# Altium project remote.PrjPcb
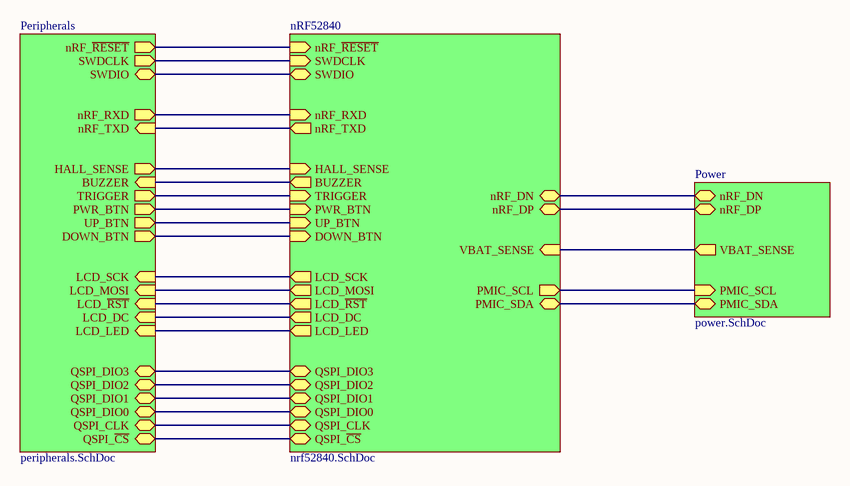
[diagram p0: remote.SchDoc]
4 sheets, 103 parts. Net scope: hierarchical (ports join the sheet entries above them; power ports are global).
Board files: remote.PcbDoc, buttons.PcbDoc
Sheets:
  remote.SchDoc
    nRF52840 = nrf52840.SchDoc
    Power = power.SchDoc
    Peripherals = peripherals.SchDoc

## Sheet remote.SchDoc: Electric Skateboard Remote
size A; Revision: 0.0.1; SheetNumber: 1

### Sub-sheets
nRF52840 = nrf52840.SchDoc: nRF_RXD (in), UP_BTN (in), QSPI_DIO1 (bidir), QSPI_~{CS} (bidir), DOWN_BTN (in), BUZZER (out), nRF_~{RESET} (in), SWDIO (bidir), LCD_DC (out), nRF_DN (bidir), QSPI_DIO0 (bidir), LCD_SCK (out), nRF_DP (bidir), QSPI_DIO2 (bidir), QSPI_CLK (bidir), SWDCLK (in), HALL_SENSE (in), LCD_MOSI (out), PWR_BTN (in), TRIGGER (in), LCD_~{RST} (out), QSPI_DIO3 (bidir), nRF_TXD (out), VBAT_SENSE (in), PMIC_SCL (out), PMIC_SDA (bidir), LCD_LED (out)
Peripherals = peripherals.SchDoc: LCD_SCK (in), LCD_MOSI (in), LCD_~{RST} (in), LCD_DC (in), SWDCLK (out), nRF_~{RESET} (out), SWDIO (bidir), nRF_TXD (in), nRF_RXD (out), QSPI_~{CS} (bidir), QSPI_CLK (bidir), QSPI_DIO0 (bidir), QSPI_DIO1 (bidir), QSPI_DIO2 (bidir), QSPI_DIO3 (bidir), LCD_LED (in), BUZZER (in), DOWN_BTN (out), TRIGGER (out), HALL_SENSE (out), PWR_BTN (out), UP_BTN (out)
Power = power.SchDoc: nRF_DP (bidir), nRF_DN (bidir), VBAT_SENSE (out), PMIC_SDA (bidir), PMIC_SCL (in)

### Nets
A8: sheet nRF52840/VBAT_SENSE, sheet Power/VBAT_SENSE
A10: sheet nRF52840/BUZZER, sheet Peripherals/BUZZER
A12: sheet nRF52840/PWR_BTN, sheet Peripherals/PWR_BTN
A14: sheet nRF52840/UP_BTN, sheet Peripherals/UP_BTN
A16: sheet nRF52840/DOWN_BTN, sheet Peripherals/DOWN_BTN
A20: sheet nRF52840/TRIGGER, sheet Peripherals/TRIGGER
AC13: sheet nRF52840/nRF_~{RESET}, sheet Peripherals/nRF_~{RESET}
AC15: sheet nRF52840/QSPI_CLK, sheet Peripherals/QSPI_CLK
AC17: sheet nRF52840/QSPI_DIO1, sheet Peripherals/QSPI_DIO1
AC19: sheet nRF52840/QSPI_DIO3, sheet Peripherals/QSPI_DIO3
AD12: sheet nRF52840/QSPI_~{CS}, sheet Peripherals/QSPI_~{CS}
AD16: sheet nRF52840/QSPI_DIO0, sheet Peripherals/QSPI_DIO0
AD18: sheet nRF52840/QSPI_DIO2, sheet Peripherals/QSPI_DIO2
J1: sheet nRF52840/LCD_LED, sheet Peripherals/LCD_LED
K2: sheet nRF52840/HALL_SENSE, sheet Peripherals/HALL_SENSE
L1: sheet nRF52840/LCD_~{RST}, sheet Peripherals/LCD_~{RST}
M2: sheet nRF52840/PMIC_SCL, sheet Power/PMIC_SCL
N1: sheet nRF52840/LCD_MOSI, sheet Peripherals/LCD_MOSI
P2: sheet nRF52840/PMIC_SDA, sheet Power/PMIC_SDA
P23: sheet nRF52840/nRF_TXD, sheet Peripherals/nRF_TXD
R1: sheet nRF52840/LCD_SCK, sheet Peripherals/LCD_SCK
R24: sheet nRF52840/nRF_RXD, sheet Peripherals/nRF_RXD
U1: sheet nRF52840/LCD_DC, sheet Peripherals/LCD_DC
USB_N: sheet nRF52840/nRF_DN, sheet Power/nRF_DN
USB_P: sheet nRF52840/nRF_DP, sheet Power/nRF_DP
NetJ1_2: sheet nRF52840/SWDCLK, sheet Peripherals/SWDCLK
NetJ1_3: sheet nRF52840/SWDIO, sheet Peripherals/SWDIO

## Sheet nrf52840.SchDoc: nRF52840
size A; DocumentNumber: 1; Revision: 0.0.1; SheetNumber: 2; SheetTotal: 4
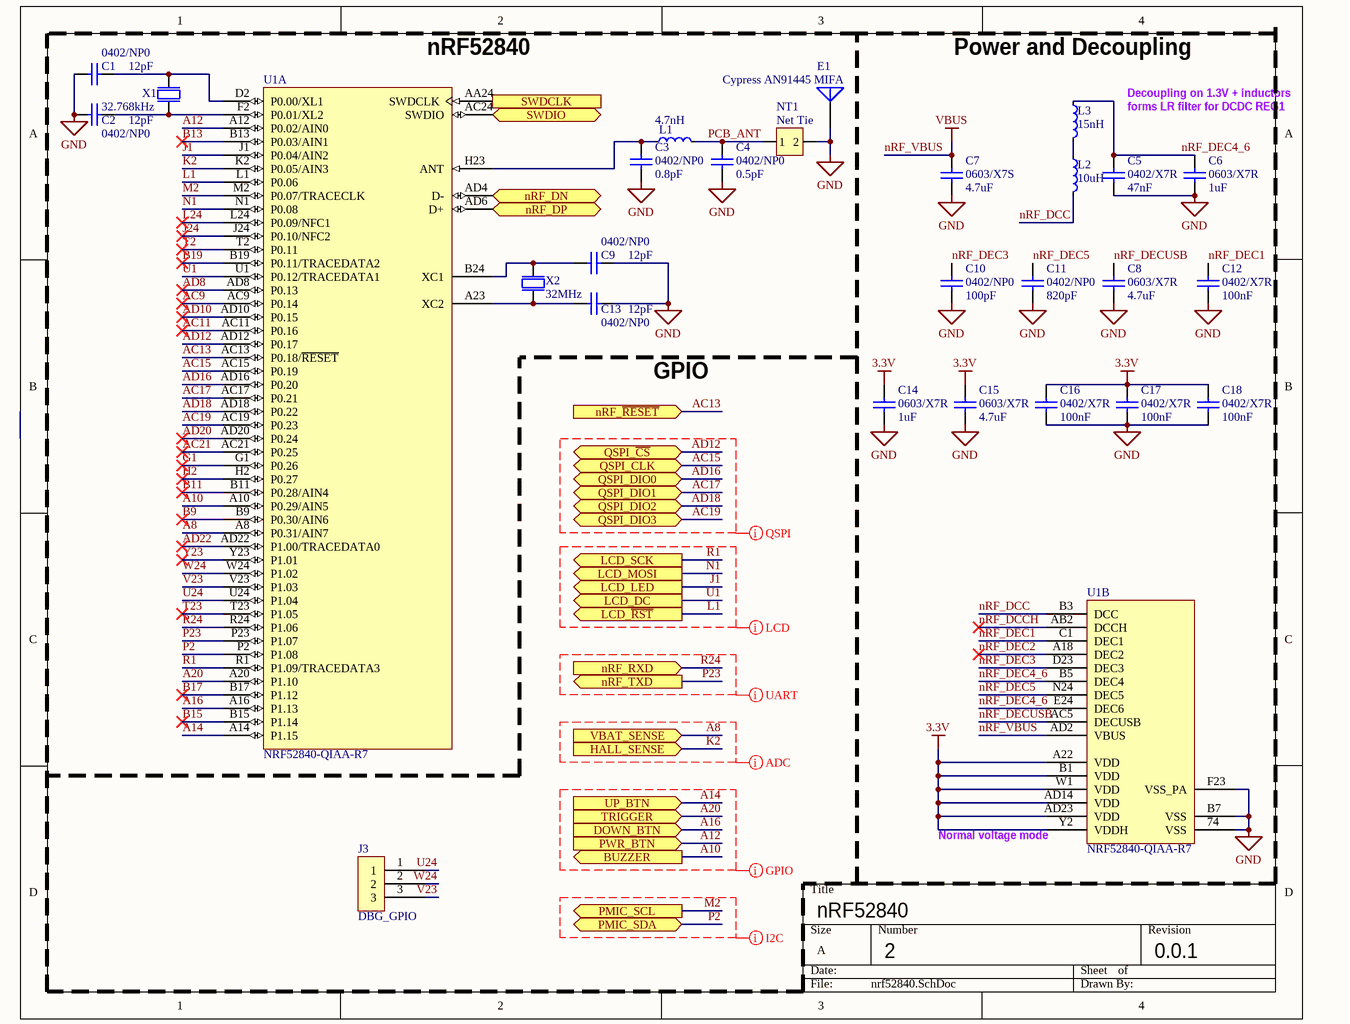
[diagram p1: nrf52840.SchDoc]

### Parts
C1  0402/NP0  value 12pF  [CAPC1005X04L]
C2  0402/NP0  value 12pF  [CAPC1005X04L]
C3  0402/NP0  value 0.8pF  [CAPC1005X04L]
C4  0402/NP0  value 0.5pF  [CAPC1005X04L]
C5  0402/X7R  value 47nF  [CAPC1005X04L]
C6  0603/X7R  value 1uF  [CAPC1608X06L]
C7  0603/X7S  value 4.7uF  [CAPC1608X06L]
C8  0603/X7R  value 4.7uF  [CAPC1608X06L]
C9  0402/NP0  value 12pF  [CAPC1005X04L]
C10  0402/NP0  value 100pF  [CAPC1005X04L]
C11  0402/NP0  value 820pF  [CAPC1005X04L]
C12  0402/X7R  value 100nF  [CAPC1005X04L]
C13  0402/NP0  value 12pF  [CAPC1005X04L]
C14  0603/X7R  value 1uF  [CAPC1608X06L]
C15  0603/X7R  value 4.7uF  [CAPC1608X06L]
C16  0402/X7R  value 100nF  [CAPC1005X04L]
C17  0402/X7R  value 100nF  [CAPC1005X04L]
C18  0402/X7R  value 100nF  [CAPC1005X04L]
E1  Cypress AN91445 MIFA  [Cypress_AN91445_MIFA]
J3  DBG_GPIO  [DBG_Header]
L1  4.7nH  [INDC1005X04L]
L2  10uH  [INDC1608X06L]
L3  15nH  [INDC1005X04L]
NT1  Net Tie  [MIFA_NET_TIE]  (net tie, no BOM)
U1  NRF52840-QIAA-R7  [AQFN50P700X700X85_HS-74N]  (parts A,B of 2)
X1  32.768kHz  [XTAL_3215]
X2  32MHz  [BT-XTAL_2016]

### Ports
BUZZER (out), DOWN_BTN (in), HALL_SENSE (in), LCD_DC (out), LCD_LED (out), LCD_MOSI (out), LCD_SCK (out), LCD_~{RST} (out), nRF_DN (bidir), nRF_DP (bidir), nRF_RXD (in), nRF_TXD (out), nRF_~{RESET} (in), PMIC_SCL (out), PMIC_SDA (bidir), PWR_BTN (in), QSPI_CLK (bidir), QSPI_DIO0 (bidir), QSPI_DIO1 (bidir), QSPI_DIO2 (bidir), QSPI_DIO3 (bidir), QSPI_~{CS} (bidir), SWDCLK (in), SWDIO (bidir), TRIGGER (in), UP_BTN (in), VBAT_SENSE (in)

### Nets
3.3V: C14.1 C15.1 C16.1 C17.1 C18.2 U1.A22(VDD) U1.AD14(VDD) U1.AD23(VDD) U1.B1(VDD) U1.W1(VDD) U1.Y2(VDDH)
GND: C1.2 C2.2 C3.2 C4.2 C5.2 C6.2 C7.2 C8.2 C9.1 C10.2 C11.2 C12.2 C13.1 C14.2 C15.2 C16.2 C17.2 C18.1 E1.1 NT1.2 U1.74(VSS) U1.B7(VSS) U1.F23(VSS_PA) X2.2(GND) X2.4(GND)
nRF_VBUS: C7.1 U1.AD2(VBUS)  [also labelled VBUS]
A8: U1.A8(P0.31/AIN7) ; port VBAT_SENSE
A10: U1.A10(P0.29/AIN5) ; port BUZZER
A12: U1.A12(P0.02/AIN0) ; port PWR_BTN
A14: U1.A14(P1.15) ; port UP_BTN
A16: U1.A16(P1.13) ; port DOWN_BTN
A20: U1.A20(P1.10) ; port TRIGGER
AC9: U1.AC9(P0.14)
AC11: U1.AC11(P0.16)
AC13: U1.AC13(P0.18/~{RESET}) ; port nRF_~{RESET}
AC15: U1.AC15(P0.19) ; port QSPI_CLK
AC17: U1.AC17(P0.21) ; port QSPI_DIO1
AC19: U1.AC19(P0.23) ; port QSPI_DIO3
AC21: U1.AC21(P0.25)
AD8: U1.AD8(P0.13)
AD10: U1.AD10(P0.15)
AD12: U1.AD12(P0.17) ; port QSPI_~{CS}
AD16: U1.AD16(P0.20) ; port QSPI_DIO0
AD18: U1.AD18(P0.22) ; port QSPI_DIO2
AD20: U1.AD20(P0.24)
AD22: U1.AD22(P1.00/TRACEDATA0)
B9: U1.B9(P0.30/AIN6)
B11: U1.B11(P0.28/AIN4)
B13: U1.B13(P0.03/AIN1)
B15: U1.B15(P1.14)
B17: U1.B17(P1.12)
B19: U1.B19(P0.11/TRACEDATA2)
G1: U1.G1(P0.26)
H2: U1.H2(P0.27)
J1: U1.J1(P0.04/AIN2) ; port LCD_LED
J24: U1.J24(P0.10/NFC2)
K2: U1.K2(P0.05/AIN3) ; port HALL_SENSE
L1: U1.L1(P0.06) ; port LCD_~{RST}
L24: U1.L24(P0.09/NFC1)
M2: U1.M2(P0.07/TRACECLK) ; port PMIC_SCL
N1: U1.N1(P0.08) ; port LCD_MOSI
nRF_DCC: L2.2 U1.B3(DCC)
nRF_DCCH: U1.AB2(DCCH)
nRF_DEC1: C12.1 U1.C1(DEC1)
nRF_DEC2: U1.A18(DEC2)
nRF_DEC3: C10.1 U1.D23(DEC3)
nRF_DEC4_6: C5.1 C6.1 L3.1 U1.B5(DEC4) U1.E24(DEC6)
nRF_DEC5: C11.1 U1.N24(DEC5)
nRF_DECUSB: C8.1 U1.AC5(DECUSB)
P2: U1.P2(P1.08) ; port PMIC_SDA
P23: U1.P23(P1.07) ; port nRF_TXD
PCB_ANT: C4.1 L1.2 NT1.1
R1: U1.R1(P1.09/TRACEDATA3) ; port LCD_SCK
R24: U1.R24(P1.06) ; port nRF_RXD
T2: U1.T2(P0.11)
T23: U1.T23(P1.05)
U1: U1.U1(P0.12/TRACEDATA1) ; port LCD_DC
U24: J3.1 U1.U24(P1.04)
USB_N: U1.AD4(D-) ; port nRF_DN
USB_P: U1.AD6(D+) ; port nRF_DP
V23: J3.3 U1.V23(P1.03)
W24: J3.2 U1.W24(P1.02)
Y23: U1.Y23(P1.01)
NetC1_1: C1.1 U1.D2(P0.00/XL1) X1.2(out)
NetC2_1: C2.1 U1.F2(P0.01/XL2) X1.1(inp)
NetC3_1: C3.1 L1.1 U1.H23(ANT)
NetC9_2: C9.2 U1.B24(XC1) X2.1(inp)
NetC13_2: C13.2 U1.A23(XC2) X2.3(out)
NetJ1_2: U1.AA24(SWDCLK) ; port SWDCLK
NetJ1_3: U1.AC24(SWDIO) ; port SWDIO
NetL2_1: L2.1 L3.2

### Layout directives
net class QSPI: AC15, AC17, AC19, AD12, AD16, AD18
net class LCD: J1, L1, N1, R1, U1
net class UART: A8, A10, A12, A14, A16, A20, K2, M2, P2, P23, R24

### Notes on the sheet
- (near U1) nRF52840
- (near L3) Power and Decoupling
- Decoupling on 1.3V + inductors
- forms LR filter for DCDC REG1
- GPIO
- (near U1) Normal voltage mode

### Library data of the parts
C1-C18 = Cap: Capacitor; Published: 8-Jun-2000; LatestRevisionDate: 17-Jul-2002; LatestRevisionNote: Re-released for DXP Platform.; PackageReference: RAD-0.3; Publisher: Altium Limited; PackageDescription: Radial Cap, Thru-Hole; 2 Leads; 0.3 in Pin Spacing; ComponentLink1Description: Digikey
  C1 C2 C9 C13: ComponentLink1URL: https://www.digikey.com/product-detail/en/walsin-technology-corporation/0402N120G500CT/1292-1250-1-ND/9355254
  C3: ComponentLink1URL: https://www.digikey.com/product-detail/en/johanson-technology-inc/500R07S0R8AV4T/712-1604-1-ND/6612940
  C4: ComponentLink1URL: https://www.digikey.com/product-detail/en/johanson-technology-inc/500R07S0R5AV4T/712-1247-1-ND/1786709
  C5: ComponentLink1URL: https://www.digikey.com/product-detail/en/w-rth-elektronik/885012205035/732-7530-1-ND/5454157
  C6 C14: ComponentLink1URL: https://www.digikey.com/product-detail/en/avx-corporation/0603YC105JAT2A/478-10814-1-ND/7536449
  C7: ComponentLink1URL: https://www.digikey.com/product-detail/en/tdk-corporation/C1608X7S1A475K080AC/445-14258-1-ND/3955924
  C8 C15: ComponentLink1URL: https://www.digikey.com/product-detail/en/samsung-electro-mechanics/CL10B475KQ8NQNC/1276-2087-1-ND/3890173
  C10: ComponentLink1URL: https://www.digikey.com/product-detail/en/samsung-electro-mechanics/CL05C101JB5NNNC/1276-1025-1-ND/3889111
  C11: ComponentLink1URL: https://www.digikey.com/product-detail/en/samsung-electro-mechanics/CL05C821JB5NNNC/1276-1727-1-ND/3889813
  C12 C16-C18: ComponentLink1URL: https://www.digikey.com/product-detail/en/w-rth-elektronik/885012205037/732-7532-1-ND/5454159
E1 = MIFA
J3 = Debug_Header
L1-L3 = IND_0402: High frequency chip inductor ±5%; Part Number: L0402-3n9; LatestRevisionDate: 2012-09-19; Pin Count: 2; Publisher: Nordic Semiconductor; Published: 2009-05-08; Note: High frequency chip inductor ±5%; Footprint Doc: 0402; ComponentLink1Description: Digikey
  L1: Value: 4.7nH; ComponentLink1URL: https://www.digikey.com/product-detail/en/delta-electronics-components/0402HC-4N7ECTS/2035-1346-1-ND/10135917
  L2: Value: 10uH; ComponentLink1URL: https://www.digikey.com/product-detail/en/tdk-corporation/MLZ1608M100WT000/445-6389-1-ND/2465716
  L3: Value: 15nH; ComponentLink1URL: https://www.digikey.com/product-detail/en/kemet/L0402C15NJRMST/399-9557-1-ND/3674135
NT1 = MIFA_NET_TIE
U1 = NRSC-NRF52840-AQFN-73: RF System on a Chip, 1.7 to 3.6 V, -40 to 85 degC, 73-Pin AQFN, RoHS, Tape and Reel; Manufacturer: Nordic Semiconductor; Package Description: 73-Pin Array Quad Flat No-lead Package, Body 7 x 7 mm, Pitch 0.5 mm; Datasheet Version: Rev. 0.5.1, 07/2017; RoHSCompliant: false; Mounting Technology: SurfaceMount; Manufacturer URL: http://www.nordicsemi.com/eng/Products/; Datasheet URL: http://infocenter.nordicsemi.com/pdf/nRF52840_OPS_v0.5.1.pdf; Package Reference: AQFN
X1 = XTAL_SMD3215: XTAL SMD 3215, 32.768kHz, Cl=9pF, Total Tol: ±50ppm; Part Number: XTAL_SMD3215_32.768kHz_9pF_General; LatestRevisionDate: 2016-08-19; Pin Count: 2; Publisher: Nordic Semiconductor; Published: 2016-08-19; Value: 32.768kHz; Footprint Doc: XTAL_3215; ComponentLink1Description: Digikey; ComponentLink1URL: https://lcsc.com/product-detail/SMD-Crystal-Resonators_JGHC-S3132768092070_C479190.html
X2 = XTAL_SMD2016: XTAL SMD 2016, 32MHz, Cl=8pF, Total Tol: ±40ppm; Part Number: XTAL_SMD2016_32MHz_8pF_General; LatestRevisionDate: 2016-08-19; Pin Count: 4; Publisher: Nordic Semiconductor; Published: 2016-08-19; Value: 32MHz; Footprint Doc: XTAL_2016; ComponentLink1Description: Digikey; ComponentLink1URL: https://www.digikey.com/product-detail/en/ecs-inc/ECS-320-8-37B-CKY-TR/XC3067CT-ND/9838882; ComponentLink2Description: Datasheet; ComponentLink2URL: https://ecsxtal.com/store/pdf/ECX-1637B.pdf

## Sheet power.SchDoc: Power
size A; Revision: 0.0.1; SheetNumber: 3; SheetTotal: 4
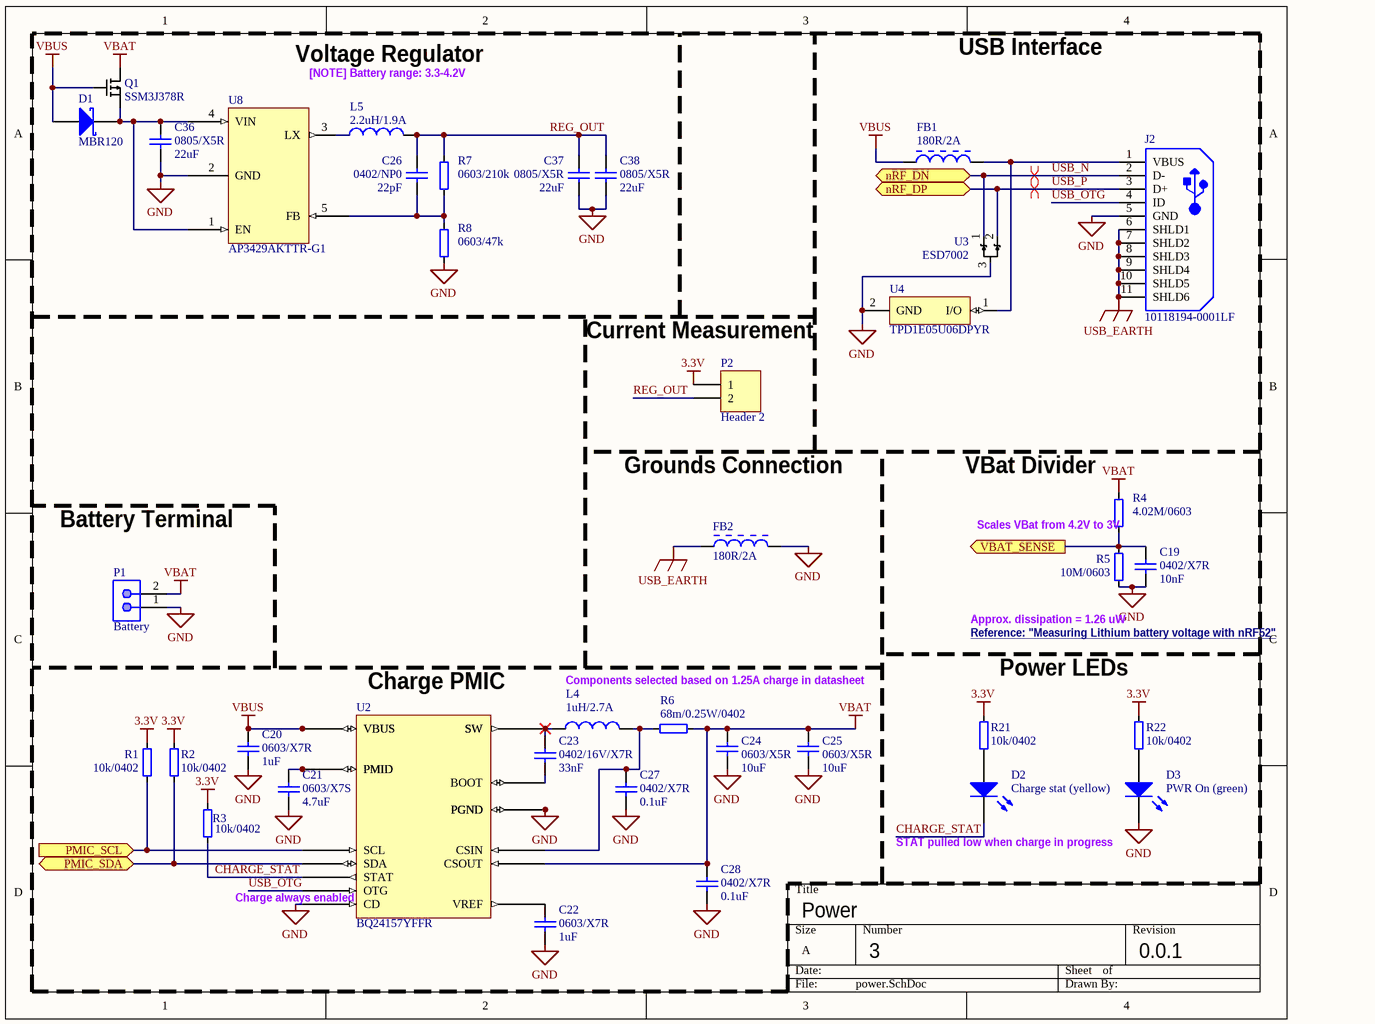
[diagram p2: power.SchDoc]

### Parts
C19  0402/X7R  value 10nF  [0402]
C20  0603/X7R  value 1uF  [CAPC1608X06L]
C21  0603/X7S  value 4.7uF  [CAPC1608X06L]
C22  0603/X7R  value 1uF  [CAPC1608X06L]
C23  0402/16V/X7R  value 33nF  [0402]
C24  0603/X5R  value 10uF  [CAPC1608X06L]
C25  0603/X5R  value 10uF  [CAPC1608X06L]
C26  0402/NP0  value 22pF  [0402]
C27  0402/X7R  value 0.1uF  [CAPC1005X04L]
C28  0402/X7R  value 0.1uF  [CAPC1005X04L]
C36  0805/X5R  value 22uF  [C0805]
C37  0805/X5R  value 22uF  [C0805]
C38  0805/X5R  value 22uF  [C0805]
D1  MBR120  [SODFL360X98-2N]
D2  Charge stat (yellow)  [3.2X1.6X1.1]
D3  PWR On (green)  [3.2X1.6X1.1]
FB1  180R/2A  [MURA-BLM18PG_KG-B25-CHIP-2_V2]
FB2  180R/2A  [MURA-BLM18PG_KG-B25-CHIP-2_V2]
J2  10118194-0001LF  [FCI-10118194-0001LF-5_V]
L4  1uH/2.7A  [INDC2520X12N]
L5  2.2uH/1.9A  [INDC2520X12N]
P1  Battery  [JST-B2B-XH-A_V]
P2  Header 2  [Current_TP]
Q1  SSM3J378R  [SOT-23_M]
R1  10k/0402  [0402]
R2  10k/0402  [0402]
R3  10k/0402  [0402]
R4  4.02M/0603  [1608[0603]]
R5  10M/0603  [1608[0603]]
R6  68m/0.25W/0402  [0402]
R7  0603/210k  [1608[0603]]
R8  0603/47k  [1608[0603]]
R21  10k/0402  [0402]
R22  10k/0402  [0402]
U2  BQ24157YFFR  [BQ24157YFFR]
U3  ESD7002  [SOT65P220X100-3N]
U4  TPD1E05U06DPYR  [0402-A]
U8  AP3429AKTTR-G1  [SOT95P280X100-5N]

### Ports
nRF_DN (bidir), nRF_DP (bidir), PMIC_SCL (in), PMIC_SDA (bidir), VBAT_SENSE (out)

### Nets
3.3V: P2.1 R1.2 R2.2 R3.2 R21.2 R22.2
GND: C19.2 C20.2 C21.2 C22.2 C24.2 C25.2 C27.1 C28.1 C36.2 C37.2 C38.2 D3.2(K) FB2.2 J2.5(GND) P1.1 R5.1 R8.1 U2.D1(PGND) U2.D2(PGND) U2.D3(PGND) U2.E2(CD) U3.3 U4.2(GND) U8.2(GND)
USB_EARTH: FB2.1 J2.6(SHLD1) J2.7(SHLD2) J2.8(SHLD3) J2.9(SHLD4) J2.10(SHLD5) J2.11(SHLD6)
VBAT: C24.1 C25.1 C28.2 P1.2 Q1.3(D) R4.2 R6.1 U2.E4(CSOUT)
VBUS: C20.1 D1.1(A) FB1.1 Q1.1(G) U2.A1(VBUS) U2.A2(VBUS)  [project net nRF_VBUS]
A8: C19.1 R4.1 R5.2 ; port VBAT_SENSE
CHARGE_STAT: D2.2(K) R3.1 U2.C4(STAT)
M2: R1.1 U2.A4(SCL) ; port PMIC_SCL
P2: R2.1 U2.B4(SDA) ; port PMIC_SDA
REG_OUT: C26.1 C37.1 C38.1 L5.2 P2.2 R7.2
USB_N: J2.2(D-) U3.1 ; port nRF_DN
USB_OTG: J2.4(ID) U2.D4(OTG)
USB_P: J2.3(D+) U3.2 ; port nRF_DP
NetC21_1: C21.1 U2.B1(PMID) U2.B2(PMID) U2.B3(PMID)
NetC22_1: C22.1 U2.E3(VREF)
NetC23_1: C23.1 L4.1 U2.C1(SW) U2.C2(SW) U2.C3(SW)
NetC23_2: C23.2 U2.A3(BOOT)
NetC26_2: C26.2 R7.1 R8.2 U8.5(FB)
NetC27_2: C27.2 L4.2 R6.2 U2.E1(CSIN)
NetC36_1: C36.1 D1.2(K) Q1.2(S) U8.1(EN) U8.4(VIN)
NetD2_1: D2.1(A) R21.1
NetD3_1: D3.1(A) R22.1
NetFB1_2: FB1.2 J2.1(VBUS) U4.1(I/O)
NetL5_1: L5.1 U8.3(LX)

### Layout directives
differential pair; differential pair class USB: USB_N, USB_P

### Notes on the sheet
- [NOTE] Battery range: 3.3-4.2V
- Voltage Regulator
- USB Interface
- (near P2) Current Measurement
- Grounds Connection
- (near R4) VBat Divider
- Battery Terminal
- (near R4) Scales VBat from 4.2V to 3V
- Approx. dissipation = 1.26 uW
- Reference: "Measuring Lithium battery voltage with nRF52" <https://devzone.nordicsemi.com/nordic/nordic-blog/b/blog/posts/measuring-lithium-battery-voltage-with-nrf52>
- (near U2) Charge PMIC
- Components selected based on 1.25A charge in datasheet
- Power LEDs
- (near U2) Charge always enabled
- STAT pulled low when charge in progress

### Library data of the parts
C19-C28 C36-C38 = Cap: Capacitor; Published: 8-Jun-2000; LatestRevisionDate: 17-Jul-2002; LatestRevisionNote: Re-released for DXP Platform.; PackageReference: RAD-0.3; Publisher: Altium Limited; PackageDescription: Radial Cap, Thru-Hole; 2 Leads; 0.3 in Pin Spacing; ComponentLink1Description: Digikey
  C19: ComponentLink1URL: https://www.digikey.com/product-detail/en/yageo/CC0402KRX7R7BB103/311-1042-1-ND/302959
  C20 C22: ComponentLink1URL: https://www.digikey.com/product-detail/en/avx-corporation/0603YC105JAT2A/478-10814-1-ND/7536449
  C21: ComponentLink1URL: https://www.digikey.com/product-detail/en/tdk-corporation/C1608X7S1A475K080AC/445-14258-1-ND/3955924
  C23: ComponentLink1URL: https://www.digikey.com/product-detail/en/samsung-electro-mechanics/CL05B333KO5NNNC/1276-1177-1-ND/3889263
  C24 C25: ComponentLink1URL: https://www.digikey.com/product-detail/en/samsung-electro-mechanics/CL10A106MQ8NNNC/1276-1119-1-ND/3889205
  C26: ComponentLink1URL: https://www.digikey.com/product-detail/en/yageo/CC0402JRNPO9BN220/311-1018-1-ND/302935
  C27 C28: ComponentLink1URL: https://www.digikey.com/product-detail/en/w-rth-elektronik/885012205037/732-7532-1-ND/5454159
  C36-C38: ComponentLink1URL: https://www.digikey.com/product-detail/en/samsung-electro-mechanics/CL21A226MQQNNNE/1276-1100-1-ND/3889186
D1 = D Schottky: Schottky Diode; Published: 8-Jun-2000; LatestRevisionDate: 17-Jul-2002; LatestRevisionNote: Re-released for DXP Platform.; PackageReference: SMB; Publisher: Altium Limited; PackageDescription: DO-214-AA/SMB; 2 C-Bend Leads; Body 5.3 x 3.6 mm, inc. leads (LxW); Code_JEDEC: DO-214-AA; ComponentLink1Description: Digikey; ComponentLink1URL: https://www.digikey.com/product-detail/en/on-semiconductor/MBR120ESFT1G/MBR120ESFT1GOSCT-ND/964525
D2 = LED2: Typical RED, GREEN, YELLOW, AMBER GaAs LED; MFG PN: LTST-C150KSKT; Published: 8-Jun-2000; LatestRevisionDate: 17-Jul-2002; LatestRevisionNote: Re-released for DXP Platform.; PackageVersion: Feb-2002; PackageReference: 3.2X1.6X1.1; Publisher: Altium Limited; PackageDescription: SM LED; 2 Flat Leads; Digikey PN: 160-1406-1-ND
D3 = LED2: Typical RED, GREEN, YELLOW, AMBER GaAs LED; MFG PN: LTST-C150KGKT; Published: 8-Jun-2000; LatestRevisionDate: 17-Jul-2002; LatestRevisionNote: Re-released for DXP Platform.; PackageVersion: Feb-2002; PackageReference: 3.2X1.6X1.1; Publisher: Altium Limited; PackageDescription: SM LED; 2 Flat Leads; Digikey PN: 160-1404-1-ND
FB1 FB2 = CMP-0686-00557-6: 180 Ohms @ 100MHz 1 Power Line Ferrite Bead 0603 (1608 Metric) 2A 50mOhm; PartNumber: MPZ1608S181ATAH0; Manufacturer: TDK Corporation; Impedance (at 100 MHz): 180 Ohm +/- 25%; Rated Current: 2000 mA; DC Resistance: 0.05 Ohm Max.; Packing: Tape and Reel; PackageDescription: 2-Pin Chip, Body 1.6 x 0.8 mm; Mounting Technology: Surface Mount; Operating Temperature Range: -55 to 125 degC; ComponentLink1Description: Digikey; ComponentLink1URL: https://www.digikey.com/product-detail/en/tdk-corporation/MPZ1608S181ATAH0/445-5220-1-ND/2117954; ComponentLink2Description: Datasheet; ComponentLink2URL: https://product.tdk.com/info/en/catalog/datasheets/beads_commercial_power_mpz1608_en.pdf
J2 = CMP-2000-05120-1: Micro USB B Type Receptacle, 1.8 A, -55 to 85 degC, 5-Pin SMD, RoHS, Tape and Reel; Manufacturer: Amphenol FCI; Body Orientation: RightAngle; Number of Contacts: 5; Pitch: 0.65mm; Gender: RCP; Rad Hard: No; Package Reference: 10118194-0001LF-5; Mounting: SurfaceMount; Manufacturer URL: http://www.fci.com/; Packaging: CutTape; Datasheet URL: https://datasheet.ciiva.com/26945/getdatasheetpartid-418619-26945695.pdf; Termination Method: Solder; Package Description: 5-Pin Surface Mount Device, Body 8.05 x 5.53 mm, Pitch 0.65 mm; Type: MicroUSBTypeB; Datasheet Version: Rev. A, 10/2011; ComponentLink1Description: Digikey; ComponentLink1URL: https://www.digikey.com/product-detail/en/amphenol-icc-fci/10118194-0001LF/609-4618-1-ND/2785382
L4 = MAMK2520T1R0M: Inductor Power Chip Wirewound 1uH 20% 2MHz Metal 2.7A 59mOhm DCR 1008 T/R; MF: Taiyo Yuden; Package: 2520 Taiyo Yuden; Digi-Key_Part_Number: 587-3225-1-ND; SnapEDA_Link: https://www.snapeda.com/parts/MAMK2520T1R0M/Taiyo%20Yuden/view-part/?ref=snap; Digi-Key_Purchase_URL: https://www.digikey.com/product-detail/en/taiyo-yuden/MAMK2520T1R0M/587-3225-1-ND/3479480?utm_source=snapeda&utm_medium=aggregator&utm_campaign=symbol; MP: MAMK2520T1R0M; Value: 1uH; ComponentLink1Description: Digikey; ComponentLink1URL: https://www.digikey.com/product-detail/en/taiyo-yuden/MAMK2520T1R0M/587-3225-1-ND/3479480
L5 = MAMK2520T1R0M: 2.2uH ±20% 1.9A 117mΩ 1008 Inductors (SMD) RoHS; MF: Taiyo Yuden; Package: 2520 Taiyo Yuden; Digi-Key_Part_Number: 587-3225-1-ND; SnapEDA_Link: https://www.snapeda.com/parts/MAMK2520T1R0M/Taiyo%20Yuden/view-part/?ref=snap; Digi-Key_Purchase_URL: https://www.digikey.com/product-detail/en/taiyo-yuden/MAMK2520T1R0M/587-3225-1-ND/3479480?utm_source=snapeda&utm_medium=aggregator&utm_campaign=symbol; MP: MAMK2520T1R0M; Value: 2.2uH; ComponentLink1Description: Digikey; ComponentLink1URL: https://www.digikey.com/product-detail/en/laird-signal-integrity-products/MGV2520122R2M-10/240-3077-1-ND/9559058
P1 = CMP-2000-05888-1: Male Header, Pitch 2.5 mm, 1 x 2 Position, Height 7 mm, Tail Length 3.4 mm, -25 to 85 degC, RoHS, Bulk; Manufacturer: JST; No of Positions: 2; Pitch: 2.5mm; Style/Orientation: StraightHeader/Plug; Datasheet Version: 05/2016; Package Description: Male Header, Pitch 2.5 mm, 1 x 2 Position, Height 7 mm, Tail Length 3.4 mm; Package Reference: B2B-XH-A; Mounting Technology: ThroughHole; Type: ShroudedHeader; Datasheet URL: http://www.jst-mfg.com/product/pdf/eng/eXH.pdf; Manufacturer URL: http://www.jst.com/home2.html; Termination: Crimp; ComponentLink1Description: Digikey; ComponentLink1URL: https://www.digikey.com/product-detail/en/jst-sales-america-inc/B2B-XH-A-LF-SN/455-2247-ND/1651045; ComponentLink2Description: Datasheet; ComponentLink2URL: http://www.jst-mfg.com/product/pdf/eng/eXH.pdf
P2 = Header 2: Header, 2-Pin; LatestRevisionDate: 17-Jul-2002; LatestRevisionNote: Re-released for DXP Platform.; Publisher: Altium Limited
Q1 = SSM3J378R: P-Channel 20V 6A (Ta) 1W (Ta) Surface Mount SOT-23F; ComponentLink1Description: Digikey; ComponentLink1URL: https://www.digikey.com/product-detail/en/toshiba-semiconductor-and-storage/SSM3J378R-LF/SSM3J378RLFCT-ND/9866097; ComponentLink2Description: Datasheet; ComponentLink2URL: https://toshiba.semicon-storage.com/info/docget.jsp?did=59205&prodName=SSM3J378R
R1-R8 R21 R22 = Resistor: Published: 8-Jun-2000; LatestRevisionDate: 17-Jul-2002; LatestRevisionNote: Re-released for DXP Platform.; PackageReference: AXIAL-0.4; Publisher: Altium Limited; PackageDescription: Axial Device, Thru-Hole; 2 Leads; 0.4 in Pin Spacing; ComponentLink1Description: Digikey
  R1-R3 R21 R22: ComponentLink1URL: https://www.digikey.com/product-detail/en/yageo/RC0402JR-0710KL/311-10KJRCT-ND/729365
  R4: ComponentLink1URL: https://www.digikey.com/product-detail/en/yageo/RC0603FR-074M02L/YAG5698CT-ND/7563718
  R5: ComponentLink1URL: https://www.digikey.com/product-detail/en/yageo/RC0603JR-0710ML/311-10MGRCT-ND/729648
  R6: ComponentLink1URL: https://www.digikey.com/product-detail/en/panasonic-electronic-components/ERJ-2BWFR068X/P.068ATCT-ND/1705799
  R7: ComponentLink1URL: https://www.digikey.com/product-detail/en/stackpole-electronics-inc/RMCF0603FT210K/RMCF0603FT210KCT-ND/2417983
  R8: ComponentLink1URL: https://www.digikey.com/product-detail/en/stackpole-electronics-inc/RMCF0603FT47K0/RMCF0603FT47K0CT-ND/1943099
U2 = BQ24157YFFR: Charger IC Lithium Ion/Polymer 20-DSBGA (2.1x2); ComponentLink1Description: Digikey; ComponentLink1URL: https://www.digikey.com/product-detail/en/texas-instruments/BQ24157YFFR/296-39908-1-ND/5177785; ComponentLink2Description: Datasheet; ComponentLink2URL: http://www.ti.com/lit/ds/symlink/bq24157.pdf; ComponentLink3Description: MFG Page; ComponentLink3URL: https://www.ti.com/product/BQ24157
U3 = ESD7002WTT1G: Clamp  Ipp Tvs Diode Surface Mount SC-70-3 (SOT323); ComponentLink1Description: Digikey; ComponentLink1URL: https://www.digikey.com/product-detail/en/on-semiconductor/ESD7002WTT1G/ESD7002WTT1GOSCT-ND/5801809; ComponentLink2Description: Datasheet; ComponentLink2URL: https://www.onsemi.com/pub/Collateral/ESD7002-D.PDF
U4 = TPD1E05U06DPYR: 14V Clamp 2.5A (8/20µs) Ipp Tvs Diode Surface Mount 2-X1SON (1x.60); ComponentLink1Description: Digikey; ComponentLink1URL: https://www.digikey.com/product-detail/en/texas-instruments/TPD1E05U06DPYR/296-39341-1-ND/5143293; ComponentLink2Description: Datasheet; ComponentLink2URL: http://www.ti.com/lit/ds/symlink/tpd1e05u06.pdf
U8 = AP3429AKTTR-G1: Buck Switching Regulator IC Positive Adjustable 0.6V 1 Output 2A SOT-23-5 Thin, TSOT-23-5; ComponentLink1Description: Digikey; ComponentLink1URL: https://www.digikey.com/product-detail/en/diodes-incorporated/AP3429AKTTR-G1/AP3429AKTTR-G1DICT-ND/5359842; ComponentLink2Description: Datasheet; ComponentLink2URL: https://www.diodes.com/assets/Datasheets/AP3429.pdf

## Sheet peripherals.SchDoc: Peripherals
size A; SheetNumber: 4; SheetTotal: 4
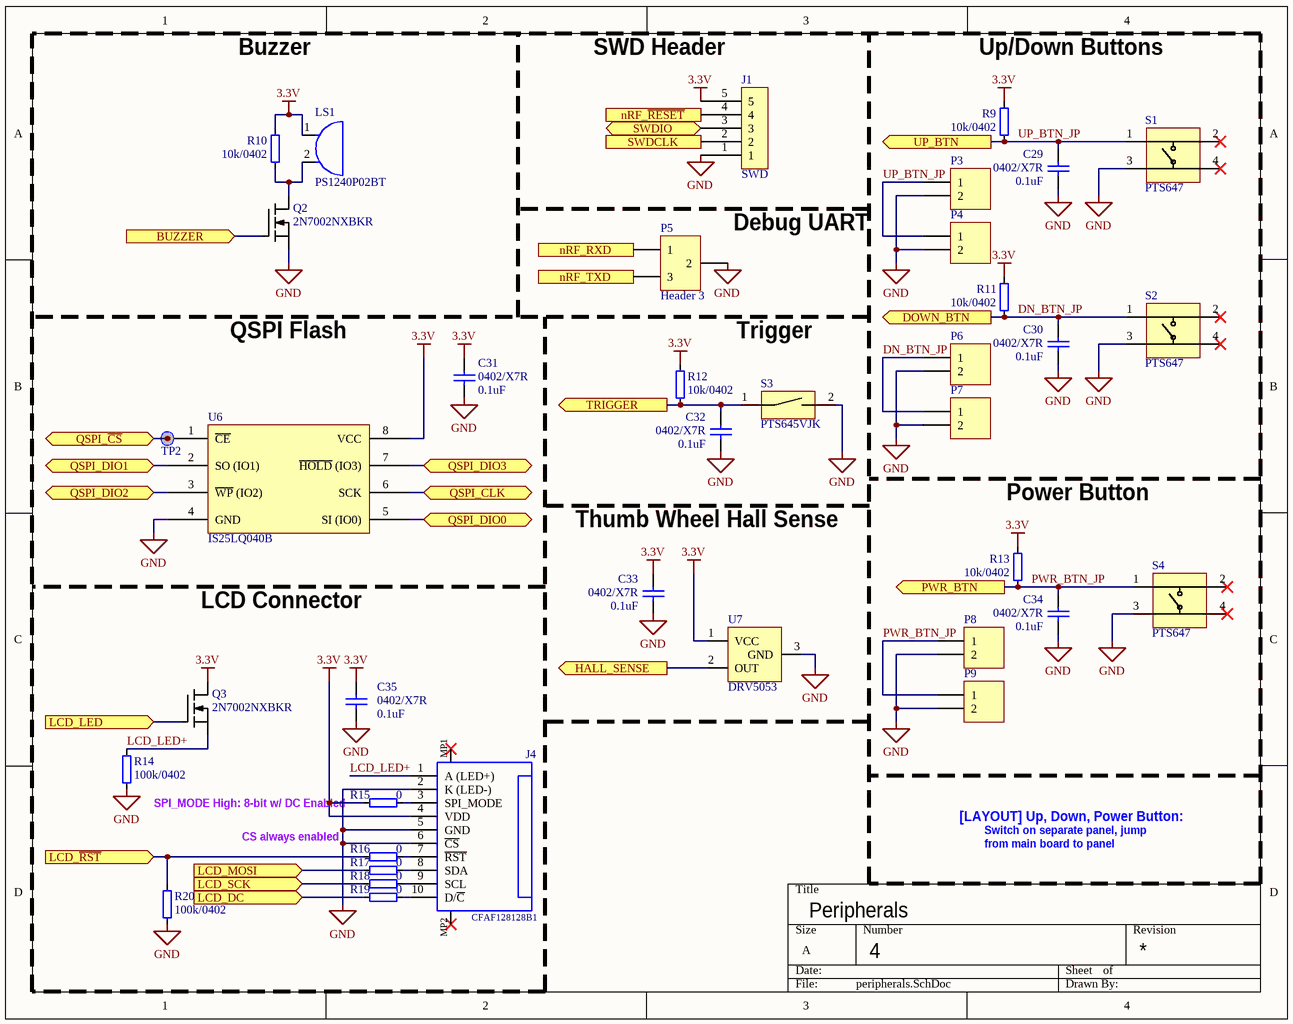
[diagram p3: peripherals.SchDoc]

### Parts
C29  0402/X7R  value 0.1uF  [CAPC1005X04L]
C30  0402/X7R  value 0.1uF  [CAPC1005X04L]
C31  0402/X7R  value 0.1uF  [CAPC1005X04L]
C32  0402/X7R  value 0.1uF  [CAPC1005X04L]
C33  0402/X7R  value 0.1uF  [CAPC1005X04L]
C34  0402/X7R  value 0.1uF  [CAPC1005X04L]
C35  0402/X7R  value 0.1uF  [CAPC1005X04L]
J1  SWD  [SWD 5-pin]
J4  CFAF128128B1  [68711014022]
LS1  PS1240P02BT  [Passive Buzzer]
P3  UP  [HDR1X2]  (value not drawn)
P4  UP  [HDR1X2]  (value not drawn)
P5  Header 3  [UART]
P6  DOWN  [HDR1X2]  (value not drawn)
P7  DOWN  [HDR1X2]  (value not drawn)
P8  POWER  [HDR1X2]  (value not drawn)
P9  POWER  [HDR1X2]  (value not drawn)
Q2  2N7002NXBKR  [SOT190P230X110-3N]
Q3  2N7002NXBKR  [SOT190P230X110-3N]
R9  10k/0402  [0402]
R10  10k/0402  [0402]
R11  10k/0402  [0402]
R12  10k/0402  [0402]
R13  10k/0402  [0402]
R14  100k/0402  [0402]
R15  value 0  [J1-0603]  (hidden comment: Resistor)
R16  value 0  [J1-0603]  (hidden comment: Resistor)
R17  value 0  [J1-0603]  (hidden comment: Resistor)
R18  value 0  [J1-0603]  (hidden comment: Resistor)
R19  value 0  [J1-0603]  (hidden comment: Resistor)
R20  100k/0402  [0402]
S1  PTS647  [SW_CK_ PTS647SK50SMTR2LFS]
S2  PTS647  [SW_CK_ PTS647SK50SMTR2LFS]
S3  PTS645VJK  [SW_CK_PTS645VJK612LFS]
S4  PTS647  [SW_CK_ PTS647SK50SMTR2LFS]
TP2  TP_Via  [TP_Via]  (value not drawn)
U6  IS25LQ040B  [SOIC127P600X175-8N]
U7  DRV5053  [SOT190P237X112-3N]

### Ports
BUZZER (in), DOWN_BTN (out), HALL_SENSE (out), LCD_DC (in), LCD_LED (in), LCD_MOSI (in), LCD_SCK (in), LCD_~{RST} (in), nRF_RXD (out), nRF_TXD (in), nRF_~{RESET} (out), PWR_BTN (out), QSPI_CLK (bidir), QSPI_DIO0 (bidir), QSPI_DIO1 (bidir), QSPI_DIO2 (bidir), QSPI_DIO3 (bidir), QSPI_~{CS} (bidir), SWDCLK (out), SWDIO (bidir), TRIGGER (out), UP_BTN (out)

### Nets
3.3V: C31.2 C33.2 C35.2 J1.5 J4.4(VDD) LS1.1 Q3.3(D) R9.2 R10.2 R11.2 R12.2 R13.2 R15.2 U6.8(VCC) U7.1(VCC)
GND: C29.1 C30.1 C31.1 C32.1 C33.1 C34.1 C35.1 J1.1 J4.2(K_(LED-)) J4.5(GND) J4.6(~{CS}) P3.2 P4.2 P5.2 P6.2 P7.2 P8.2 P9.2 Q2.2(S) R14.1 R20.1 S1.3 S2.3 S3.2 S4.3 U6.4(GND) U7.3(GND)
A10: Q2.1(G) ; port BUZZER
A20: C32.2 R12.1 S3.1 ; port TRIGGER
AC13: J1.4 ; port nRF_~{RESET}
AC15: U6.6(SCK) ; port QSPI_CLK
AC17: U6.2(SO_(IO1)) ; port QSPI_DIO1
AC19: U6.7(~{HOLD}_(IO3)) ; port QSPI_DIO3
AD12: TP2.1 U6.1(~{CE}) ; port QSPI_~{CS}
AD16: U6.5(SI_(IO0)) ; port QSPI_DIO0
AD18: U6.3(~{WP}_(IO2)) ; port QSPI_DIO2
DN_BTN_JP: C30.2 P6.1 P7.1 R11.1 S2.1 ; port DOWN_BTN  [project net A16]
J1: Q3.1(G) ; port LCD_LED
K2: U7.2(OUT) ; port HALL_SENSE
L1: R16.2 R20.2 ; port LCD_~{RST}
LCD_LED+: J4.1(A_(LED+)) Q3.2(S) R14.2
N1: R17.2 ; port LCD_MOSI
P23: P5.3 ; port nRF_TXD
PWR_BTN_JP: C34.2 P8.1 P9.1 R13.1 S4.1 ; port PWR_BTN  [project net A12]
R1: R18.2 ; port LCD_SCK
R24: P5.1 ; port nRF_RXD
U1: R19.2 ; port LCD_DC
UP_BTN_JP: C29.2 P3.1 P4.1 R9.1 S1.1 ; port UP_BTN  [project net A14]
NetJ1_2: J1.2 ; port SWDCLK
NetJ1_3: J1.3 ; port SWDIO
NetJ4_3: J4.3(SPI_MODE) R15.1
NetJ4_7: J4.7(~{RST}) R16.1
NetJ4_8: J4.8(SDA) R17.1
NetJ4_9: J4.9(SCL) R18.1
NetJ4_10: J4.10(D/~{C}) R19.1
NetLS1_2: LS1.2 Q2.3(D) R10.1

Not connected (* = marked no-connect by the designer): J4 MP1* MP2*; S1 2* 4*; S2 2* 4*; S4 2* 4*

### Notes on the sheet
- Buzzer
- (near J1) SWD Header
- (near R9) Up/Down Buttons
- Debug UART
- QSPI Flash
- Trigger
- (near R13) Power Button
- Thumb Wheel Hall Sense
- LCD Connector
- (near R15) SPI_MODE High: 8-bit w/ DC Enabled
- CS always enabled
- Switch on separate panel, jump
- from main board to panel
- [LAYOUT] Up, Down, Power Button:

### Library data of the parts
C29-C35 = Cap: Capacitor; Published: 8-Jun-2000; LatestRevisionDate: 17-Jul-2002; LatestRevisionNote: Re-released for DXP Platform.; PackageReference: RAD-0.3; Publisher: Altium Limited; PackageDescription: Radial Cap, Thru-Hole; 2 Leads; 0.3 in Pin Spacing; ComponentLink1Description: Digikey; ComponentLink1URL: https://www.digikey.com/product-detail/en/w-rth-elektronik/885012205037/732-7532-1-ND/5454159
J1 = Debug_Header
J4 = CFAF128128B1-0145T: 10-pin 0.5mm pitch FPC for CFAF128128B1 TFT LCD; Manufacturer: Wurth Elektronik; Withstanding Voltage: 250VAC; Working Voltage: 50VAC; Rated Current: 0.5A; Contact Resistance: 20mOhm; Pin Number: 10; Contact Design: TopContact; Operating Temperature: -25to85degC; Manufacturer URL: http://www.we-online.de; Part Number: 68711014022; Pitch: 0.5mm; Publisher: WurthElektronik; Mounting Technology: SMT; Datasheet URL: https://katalog.we-online.de/em/datasheet/68711014022.pdf; Orientation: Horizontal; Package Reference: 68711014022; Packaging: TapeandReel; ComponentLink1Description: FPC Digikey; ComponentLink1URL: https://www.digikey.com/product-detail/en/5034801000/WM1389CT-ND/2356643; ComponentLink2Description: LCD MFG; ComponentLink2URL: https://www.crystalfontz.com/product/cfaf128128b10145t-128x128-graphic-tft-spi
LS1 = PS1240P02BT: Buzzers Transducer, Externally Driven Piezo 3V  4kHz 60dB @ 3V, 10cm Through Hole PC Pins; ComponentLink1Description: Digikey; ComponentLink1URL: https://www.digikey.com/product-detail/en/tdk-corporation/PS1240P02BT/445-2525-1-ND/935930; ComponentLink2Description: Datasheet; ComponentLink2URL: https://product.tdk.com/info/en/catalog/datasheets/piezoelectronic_buzzer_ps_en.pdf
P3 P4 P6-P9 = Header 2: Header, 2-Pin; LatestRevisionDate: 17-Jul-2002; LatestRevisionNote: Re-released for DXP Platform.; Publisher: Altium Limited
P5 = Header 3: Header, 3-Pin; LatestRevisionDate: 17-Jul-2002; LatestRevisionNote: Re-released for DXP Platform.; Publisher: Altium Limited
Q2 Q3 = 2N7002NXBKR: N-Channel 60V 270mA (Ta), 330mA (Tc) 310mW (Ta), 1.67W (Tc) Surface Mount TO-236AB; ComponentLink1Description: Digikey; ComponentLink1URL: https://www.digikey.com/product-detail/en/nexperia-usa-inc/2N7002NXBKR/1727-8642-1-ND/10416559; ComponentLink2Description: Datasheet; ComponentLink2URL: https://assets.nexperia.com/documents/data-sheet/2N7002NXBK.pdf
R9-R14 R20 = Resistor: Published: 8-Jun-2000; LatestRevisionDate: 17-Jul-2002; LatestRevisionNote: Re-released for DXP Platform.; PackageReference: AXIAL-0.4; Publisher: Altium Limited; PackageDescription: Axial Device, Thru-Hole; 2 Leads; 0.4 in Pin Spacing; ComponentLink1Description: Digikey
  R9-R13: ComponentLink1URL: https://www.digikey.com/product-detail/en/yageo/RC0402JR-0710KL/311-10KJRCT-ND/729365
  R14 R20: ComponentLink1URL: https://www.digikey.com/product-detail/en/yageo/RC0402FR-07100KL/311-100KLRCT-ND/729473
R15-R19 = Resistor: 0 Ohms Jumper Chip Resistor 0603 (1608 Metric) Automotive AEC-Q200, Moisture Resistant Metal Element; Published: 8-Jun-2000; LatestRevisionDate: 17-Jul-2002; LatestRevisionNote: Re-released for DXP Platform.; PackageReference: AXIAL-0.4; Publisher: Altium Limited; PackageDescription: Axial Device, Thru-Hole; 2 Leads; 0.4 in Pin Spacing; ComponentLink1Description: Digikey; ComponentLink1URL: https://www.digikey.com/product-detail/en/koa-speer-electronics-inc/RK73Z1JTTD/2019-RK73Z1JTTDCT-ND/9847522
S1 S2 S4 = SW_CK_ PTS647SK50SMTR2LFS: Tactile Switch SPST-NO Top Actuated Surface Mount; ComponentLink1Description: Digikey; ComponentLink1URL: https://www.digikey.com/product-detail/en/c-k/PTS-647-SK50-SMTR2-LFS/PTS647SK50SMTR2LFSCT-ND/9649868; ComponentLink2Description: Datasheet; ComponentLink2URL: https://dznh3ojzb2azq.cloudfront.net/products/Tactile/PTS647/documents/datasheet.pdf
S3 = SW_CK_PTS645VJK612LFS: Tactile Switch SPST-NO Side Actuated Through Hole, Right Angle; ComponentLink1Description: Digikey; ComponentLink1URL: https://www.digikey.com/product-detail/en/c-k/PTS645VJK612LFS/CKN10826-ND/7056048; ComponentLink2Description: Datasheet; ComponentLink2URL: https://dznh3ojzb2azq.cloudfront.net/products/Tactile/PTS645/documents/datasheet.pdf
TP2 = TP_Via: Test point as a via
U6 = IS25LQ040B-JNLE: FLASH - NOR Memory IC 4Mb (512K x 8) SPI - Quad I/O 104MHz  8-SOIC; ComponentLink1Description: Digikey; ComponentLink1URL: https://www.digikey.com/product-detail/en/issi-integrated-silicon-solution-inc/IS25LQ040B-JNLE/706-1316-ND/5189751; ComponentLink2Description: Datasheet; ComponentLink2URL: http://www.issi.com/WW/pdf/25LQ025B-512B-010B-020B-040B.pdf
U7 = DRV5053VAQDBZR: Hall Effect Sensor Single Axis SOT-23-3; ComponentLink1Description: Digikey; ComponentLink1URL: https://www.digikey.com/product-detail/en/texas-instruments/DRV5053VAQDBZR/296-38460-1-ND/5022225; ComponentLink2Description: Datasheet; ComponentLink2URL: http://www.ti.com/lit/ds/symlink/drv5053.pdf

## Nets that join several sheets
3.3V: nrf52840 (11 pins), power (6 pins), peripherals (15 pins)
GND: nrf52840 (25 pins), power (24 pins), peripherals (27 pins)
nRF_VBUS: nrf52840 (C7.1 U1.AD2), power (6 pins)
A8: nrf52840 (U1.A8), power (C19.1 R4.1 R5.2)
A10: nrf52840 (U1.A10), peripherals (Q2.1)
A12: nrf52840 (U1.A12), peripherals (5 pins)
A14: nrf52840 (U1.A14), peripherals (5 pins)
A16: nrf52840 (U1.A16), peripherals (5 pins)
A20: nrf52840 (U1.A20), peripherals (C32.2 R12.1 S3.1)
AC13: nrf52840 (U1.AC13), peripherals (J1.4)
AC15: nrf52840 (U1.AC15), peripherals (U6.6)
AC17: nrf52840 (U1.AC17), peripherals (U6.2)
AC19: nrf52840 (U1.AC19), peripherals (U6.7)
AD12: nrf52840 (U1.AD12), peripherals (TP2.1 U6.1)
AD16: nrf52840 (U1.AD16), peripherals (U6.5)
AD18: nrf52840 (U1.AD18), peripherals (U6.3)
J1: nrf52840 (U1.J1), peripherals (Q3.1)
K2: nrf52840 (U1.K2), peripherals (U7.2)
L1: nrf52840 (U1.L1), peripherals (R16.2 R20.2)
M2: nrf52840 (U1.M2), power (R1.1 U2.A4)
N1: nrf52840 (U1.N1), peripherals (R17.2)
NetJ1_2: nrf52840 (U1.AA24), peripherals (J1.2)
NetJ1_3: nrf52840 (U1.AC24), peripherals (J1.3)
P2: nrf52840 (U1.P2), power (R2.1 U2.B4)
P23: nrf52840 (U1.P23), peripherals (P5.3)
R1: nrf52840 (U1.R1), peripherals (R18.2)
R24: nrf52840 (U1.R24), peripherals (P5.1)
U1: nrf52840 (U1.U1), peripherals (R19.2)
USB_N: nrf52840 (U1.AD4), power (J2.2 U3.1)
USB_P: nrf52840 (U1.AD6), power (J2.3 U3.2)

## Assembly variants
Populated Only: not fitted E1 J1 J3 NT1 P2 P3 P4 P5 P6 P7 P8 P9 TP2 U3 U4